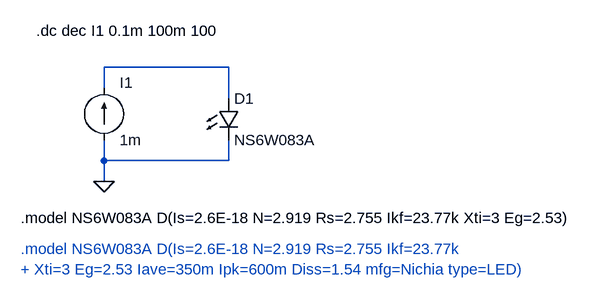
[diagram p0: schematic LED_NS6W083A.asc]
LED_NS6W083A.asc, the LTspice schematic file:
Version 4
SHEET 1 924 680
WIRE 240 96 48 96
WIRE 48 128 48 96
WIRE 240 144 240 96
WIRE 48 240 48 208
WIRE 240 240 240 208
WIRE 240 240 48 240
WIRE 48 272 48 240
FLAG 48 272 0
SYMBOL LED 224 144 R0
SYMATTR InstName D1
SYMATTR Value NS6W083A
SYMBOL current 48 208 M180
WINDOW 0 24 88 Left 0
WINDOW 3 24 0 Left 0
SYMATTR InstName I1
SYMATTR Value 1m
TEXT -80 328 Left 0 !.model NS6W083A D(Is=2.6E-18 N=2.919 Rs=2.755 Ikf=23.77k Xti=3 Eg=2.53)
TEXT -80 376 Left 0 ;.model NS6W083A D(Is=2.6E-18 N=2.919 Rs=2.755 Ikf=23.77k\n+ Xti=3 Eg=2.53 Iave=350m Ipk=600m Diss=1.54 mfg=Nichia type=LED)
TEXT -56 40 Left 0 !.dc dec I1 0.1m 100m 100

The netlist it stands for:
* LED_NS6W083A.asc
D1 N001 0 NS6W083A
I1 0 N001 1m
.model D D
.lib standard.dio
.model NS6W083A D(Is=2.6E-18 N=2.919 Rs=2.755 Ikf=23.77k Xti=3 Eg=2.53)
* .model NS6W083A D(Is=2.6E-18 N=2.919 Rs=2.755 Ikf=23.77k
* + Xti=3 Eg=2.53 Iave=350m Ipk=600m Diss=1.54 mfg=Nichia type=LED)
.dc dec I1 0.1m 100m 100
.backanno
.end